# Altium schematic sheet ADC-RDC.SchDoc
size A4
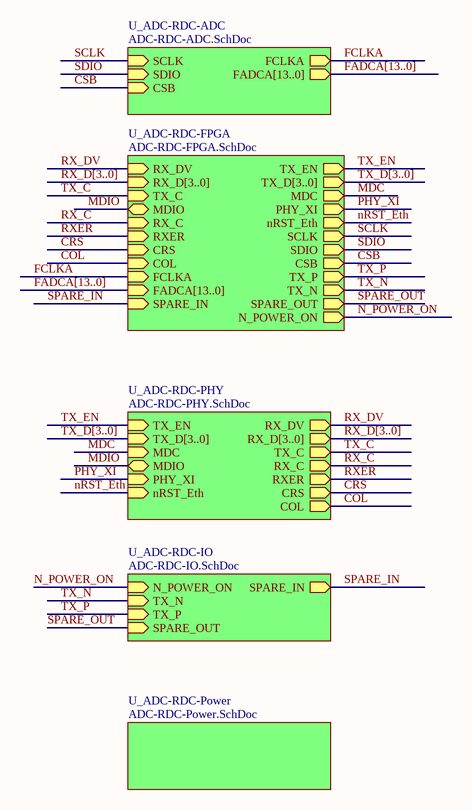
[diagram p0: ADC-RDC.SchDoc]

## Sub-sheets
U_ADC-RDC-ADC = ADC-RDC-ADC.SchDoc: SCLK (in), SDIO (in), CSB (in), FCLKA (out), FADCA[13..0] (out)
U_ADC-RDC-FPGA = ADC-RDC-FPGA.SchDoc: TX_EN (out), TX_D[3..0] (out), RX_DV (in), RX_D[3..0] (in), TX_C (in), MDC (out), MDIO (bidir), PHY_XI (out), nRST_Eth (out), RX_C (in), RXER (in), CRS (in), COL (in), FCLKA (in), FADCA[13..0] (in), SCLK (out), SDIO (out), CSB (out), TX_P (out), TX_N (out), SPARE_OUT (out), SPARE_IN (in), N_POWER_ON (out)
U_ADC-RDC-IO = ADC-RDC-IO.SchDoc: N_POWER_ON (in), TX_P (in), TX_N (in), SPARE_OUT (in), SPARE_IN (out)
U_ADC-RDC-PHY = ADC-RDC-PHY.SchDoc: TX_EN (in), TX_D[3..0] (in), RX_DV (out), RX_D[3..0] (out), TX_C (out), MDC (in), MDIO (bidir), PHY_XI (in), nRST_Eth (in), RX_C (out), RXER (out), CRS (out), COL (out)
U_ADC-RDC-Power = ADC-RDC-Power.SchDoc: no entries

## Nets
COL: sheet U_ADC-RDC-PHY/COL, sheet U_ADC-RDC-FPGA/COL
CRS: sheet U_ADC-RDC-PHY/CRS, sheet U_ADC-RDC-FPGA/CRS
CSB: sheet U_ADC-RDC-ADC/CSB, sheet U_ADC-RDC-FPGA/CSB
FCLKA: sheet U_ADC-RDC-ADC/FCLKA, sheet U_ADC-RDC-FPGA/FCLKA
MDC: sheet U_ADC-RDC-PHY/MDC, sheet U_ADC-RDC-FPGA/MDC
MDIO: sheet U_ADC-RDC-PHY/MDIO, sheet U_ADC-RDC-FPGA/MDIO
N_POWER_ON: sheet U_ADC-RDC-IO/N_POWER_ON, sheet U_ADC-RDC-FPGA/N_POWER_ON
nRST_Eth: sheet U_ADC-RDC-PHY/nRST_Eth, sheet U_ADC-RDC-FPGA/nRST_Eth
PHY_XI: sheet U_ADC-RDC-PHY/PHY_XI, sheet U_ADC-RDC-FPGA/PHY_XI
RX_C: sheet U_ADC-RDC-PHY/RX_C, sheet U_ADC-RDC-FPGA/RX_C
RX_DV: sheet U_ADC-RDC-PHY/RX_DV, sheet U_ADC-RDC-FPGA/RX_DV
RXER: sheet U_ADC-RDC-PHY/RXER, sheet U_ADC-RDC-FPGA/RXER
SCLK: sheet U_ADC-RDC-ADC/SCLK, sheet U_ADC-RDC-FPGA/SCLK
SDIO: sheet U_ADC-RDC-ADC/SDIO, sheet U_ADC-RDC-FPGA/SDIO
SPARE_IN: sheet U_ADC-RDC-IO/SPARE_IN, sheet U_ADC-RDC-FPGA/SPARE_IN
SPARE_OUT: sheet U_ADC-RDC-IO/SPARE_OUT, sheet U_ADC-RDC-FPGA/SPARE_OUT
TX_C: sheet U_ADC-RDC-PHY/TX_C, sheet U_ADC-RDC-FPGA/TX_C
TX_EN: sheet U_ADC-RDC-PHY/TX_EN, sheet U_ADC-RDC-FPGA/TX_EN
TX_N: sheet U_ADC-RDC-IO/TX_N, sheet U_ADC-RDC-FPGA/TX_N
TX_P: sheet U_ADC-RDC-IO/TX_P, sheet U_ADC-RDC-FPGA/TX_P

## Buses and harness runs
bus FADCA[13..0] = sheet U_ADC-RDC-ADC/FADCA[13..0]
bus FADCA[13..0] = sheet U_ADC-RDC-FPGA/FADCA[13..0]
bus RX_D[3..0] = sheet U_ADC-RDC-FPGA/RX_D[3..0]
bus RX_D[3..0] = sheet U_ADC-RDC-PHY/RX_D[3..0]
bus TX_D[3..0] = sheet U_ADC-RDC-FPGA/TX_D[3..0]
bus TX_D[3..0] = sheet U_ADC-RDC-PHY/TX_D[3..0]